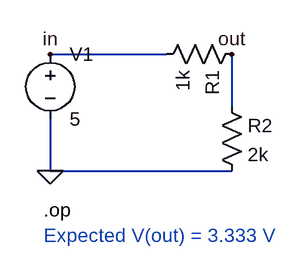
[diagram p0: schematic 01_op_voltage_divider.asc]
01_op_voltage_divider.asc, the LTspice schematic file:
Version 4
SHEET 1 880 680
WIRE 80 96 224 96
WIRE 304 96 304 160
WIRE 80 176 80 240
WIRE 80 240 304 240
FLAG 80 240 0
FLAG 80 96 in
FLAG 304 96 out
SYMBOL voltage 80 80 R0
SYMATTR InstName V1
SYMATTR Value 5
SYMBOL res 320 80 R90
SYMATTR InstName R1
SYMATTR Value 1k
SYMBOL res 288 144 R0
SYMATTR InstName R2
SYMATTR Value 2k
TEXT 72 288 Left 2 !.op
TEXT 72 320 Left 2 ;Expected V(out) = 3.333 V

The netlist it stands for:
* 01_op_voltage_divider.asc
V1 in 0 5
R1 out in 1k
R2 out 0 2k
.op
* Expected V(out) = 3.333 V
.backanno
.end